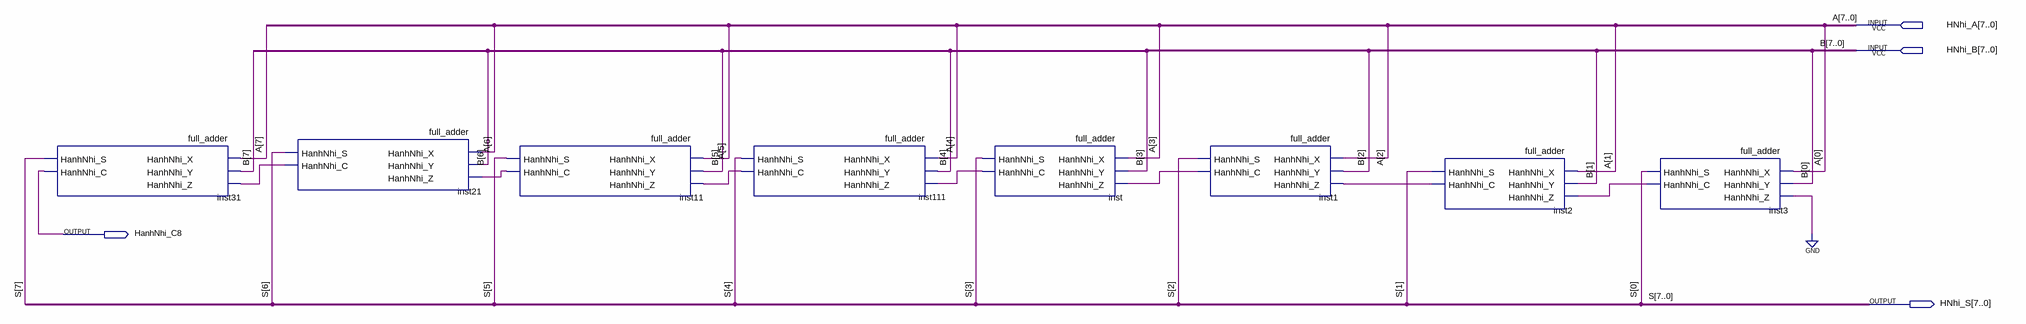
[diagram p0: schematic sheet]
// Quartus schematic adder_8.bdf as structural Verilog: 8 symbols, 4 pins
module adder_8 (
  input  [7:0] HNhi_A,
  input  [7:0] HNhi_B,
  output HanhNhi_C8,
  output [7:0] HNhi_S
);

  wire inst1_hanhnhi_c, inst2_hanhnhi_c, inst3_hanhnhi_c, inst11_hanhnhi_c, inst21_hanhnhi_c,
       inst111_hanhnhi_c, inst_hanhnhi_c;

  full_adder inst31 (
    .HanhNhi_X(HNhi_A[7]), .HanhNhi_Y(HNhi_B[7]), .HanhNhi_Z(inst21_hanhnhi_c), .HanhNhi_S(HNhi_S[7]),
    .HanhNhi_C(HanhNhi_C8));
  full_adder inst21 (
    .HanhNhi_X(HNhi_A[6]), .HanhNhi_Y(HNhi_B[6]), .HanhNhi_Z(inst11_hanhnhi_c), .HanhNhi_S(HNhi_S[6]),
    .HanhNhi_C(inst21_hanhnhi_c));
  full_adder inst11 (
    .HanhNhi_X(HNhi_A[5]), .HanhNhi_Y(HNhi_B[5]), .HanhNhi_Z(inst111_hanhnhi_c), .HanhNhi_S(HNhi_S[5]),
    .HanhNhi_C(inst11_hanhnhi_c));
  full_adder inst111 (
    .HanhNhi_X(HNhi_A[4]), .HanhNhi_Y(HNhi_B[4]), .HanhNhi_Z(inst_hanhnhi_c), .HanhNhi_S(HNhi_S[4]),
    .HanhNhi_C(inst111_hanhnhi_c));
  full_adder inst (
    .HanhNhi_X(HNhi_A[3]), .HanhNhi_Y(HNhi_B[3]), .HanhNhi_Z(inst1_hanhnhi_c), .HanhNhi_S(HNhi_S[3]),
    .HanhNhi_C(inst_hanhnhi_c));
  full_adder inst1 (
    .HanhNhi_X(HNhi_A[2]), .HanhNhi_Y(HNhi_B[2]), .HanhNhi_Z(inst2_hanhnhi_c), .HanhNhi_S(HNhi_S[2]),
    .HanhNhi_C(inst1_hanhnhi_c));
  full_adder inst2 (
    .HanhNhi_X(HNhi_A[1]), .HanhNhi_Y(HNhi_B[1]), .HanhNhi_Z(inst3_hanhnhi_c), .HanhNhi_S(HNhi_S[1]),
    .HanhNhi_C(inst2_hanhnhi_c));
  full_adder inst3 (
    .HanhNhi_X(HNhi_A[0]), .HanhNhi_Y(HNhi_B[0]), .HanhNhi_Z(1'b0), .HanhNhi_S(HNhi_S[0]),
    .HanhNhi_C(inst3_hanhnhi_c));

  // Other names for the same wires on the sheet: A[7:0] = HNhi_A; B[7:0] = HNhi_B; S[7:0] = HNhi_S
endmodule
